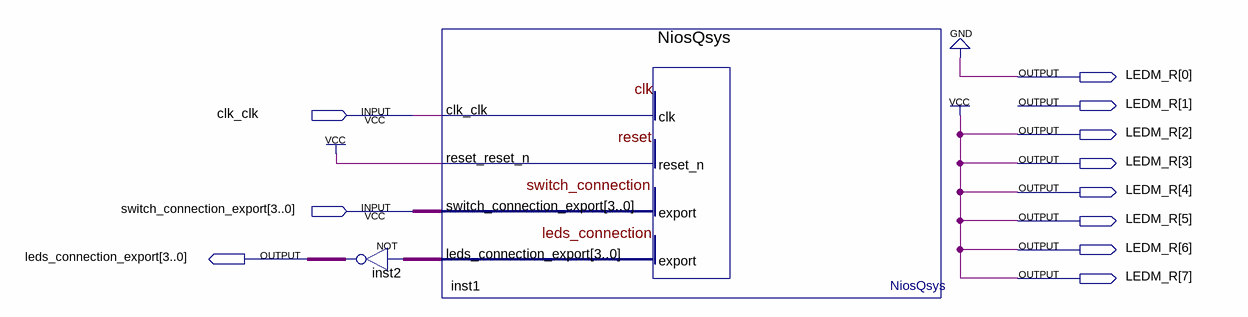
[diagram p0: schematic sheet]
// Quartus schematic NiosII.bdf as structural Verilog: 2 symbols, 11 pins
module NiosII (
  input  clk_clk,
  input  [3:0] switch_connection_export,
  output [7:0] LEDM_R,
  output [3:0] leds_connection_export
);

  wire [3:0] inst1_leds_connection_export;

  assign leds_connection_export = ~inst1_leds_connection_export;  // NOT inst2, 4 bits wide
  NiosQsys inst1 (
    .clk_clk(clk_clk), .reset_reset_n(1'b1), .switch_connection_export(switch_connection_export),
    .leds_connection_export(inst1_leds_connection_export));

  assign {LEDM_R[7:2], LEDM_R[0]} = 7'b1111110;
endmodule
